# Altium schematic sheet emoc.SchDoc
size A4
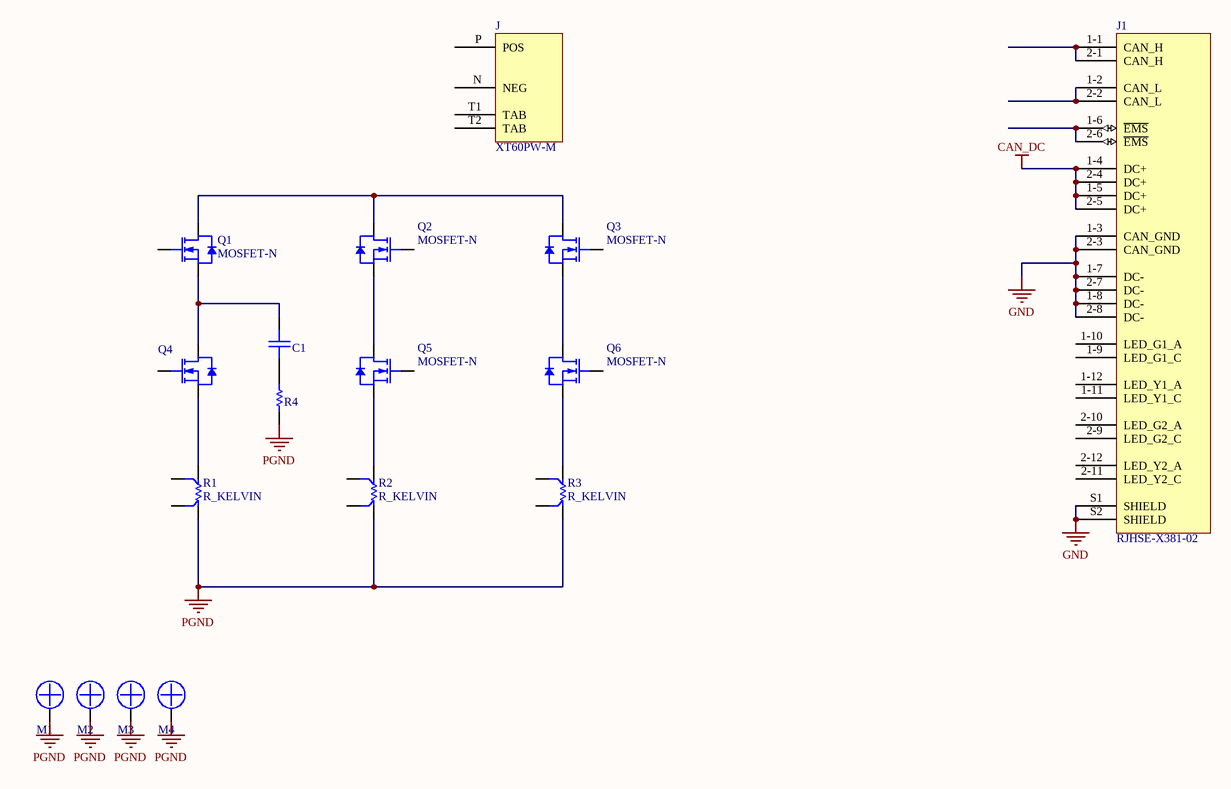
[diagram p0: emoc.SchDoc]

## Parts
C1  (no value)  [C0603N]
J  XT60PW-M  [XT60PW-M]
J1  RJHSE-X381-02  [RJHSE-X38X-02]
M1  Mounting_Screw  [MOUNT_HOLE_3.2]  (value not drawn)
M2  Mounting_Screw  [MOUNT_HOLE_3.2]  (value not drawn)
M3  Mounting_Screw  [MOUNT_HOLE_3.2]  (value not drawn)
M4  Mounting_Screw  [MOUNT_HOLE_3.2]  (value not drawn)
Q1  MOSFET-N  [DFN-5 (SO-8FL)]
Q2  MOSFET-N  [DFN-5 (SO-8FL)]
Q3  MOSFET-N  [DFN-5 (SO-8FL)]
Q4  MOSFET-N  [DFN-5 (SO-8FL)]  (value not drawn)
Q5  MOSFET-N  [DFN-5 (SO-8FL)]
Q6  MOSFET-N  [DFN-5 (SO-8FL)]
R1  R_KELVIN  [CSS2H-2512N_KELVIN]
R2  R_KELVIN  [CSS2H-2512N_KELVIN]
R3  R_KELVIN  [CSS2H-2512N_KELVIN]
R4  (no value)  [CR0805]

## Nets
CAN_DC: J1.1-4(DC+) J1.1-5(DC+) J1.2-4(DC+) J1.2-5(DC+)
GND: J1.1-3(CAN_GND) J1.1-7(DC-) J1.1-8(DC-) J1.2-3(CAN_GND) J1.2-7(DC-) J1.2-8(DC-) J1.S1(SHIELD) J1.S2(SHIELD)
PGND: M1.1 M2.1 M3.1 M4.1 R1.1 R2.1 R3.1 R4.2
NetC1_1: C1.1 R4.1
NetC1_2: C1.2 Q1.S Q4.D
NetJ1_1-1: J1.1-1(CAN_H) J1.2-1(CAN_H)
NetJ1_1-2: J1.1-2(CAN_L) J1.2-2(CAN_L)
NetJ1_1-6: J1.1-6(~{EMS}) J1.2-6(~{EMS})
NetQ1_D: Q1.D Q2.D Q3.D
NetQ2_S: Q2.S Q5.D
NetQ3_S: Q3.S Q6.D
NetQ4_S: Q4.S R1.2
NetQ5_S: Q5.S R2.2
NetQ6_S: Q6.S R3.2

Not connected (* = marked no-connect by the designer): J N(NEG) P(POS) T1(TAB) T2(TAB); J1 1-9(LED_G1_C) 1-10(LED_G1_A) 1-11(LED_Y1_C) 1-12(LED_Y1_A) 2-9(LED_G2_C) 2-10(LED_G2_A) 2-11(LED_Y2_C) 2-12(LED_Y2_A); Q1 G; Q2 G; Q3 G; Q4 G; Q5 G; Q6 G; R1 3 4; R2 3 4; R3 3 4

## Library data of the parts
C1 = C
J = XT60PW-M: XT60, Male, THT, R/A
R4 = R